# EAGLE schematic csa_bios_v3.0f (EAGLE 5.11)
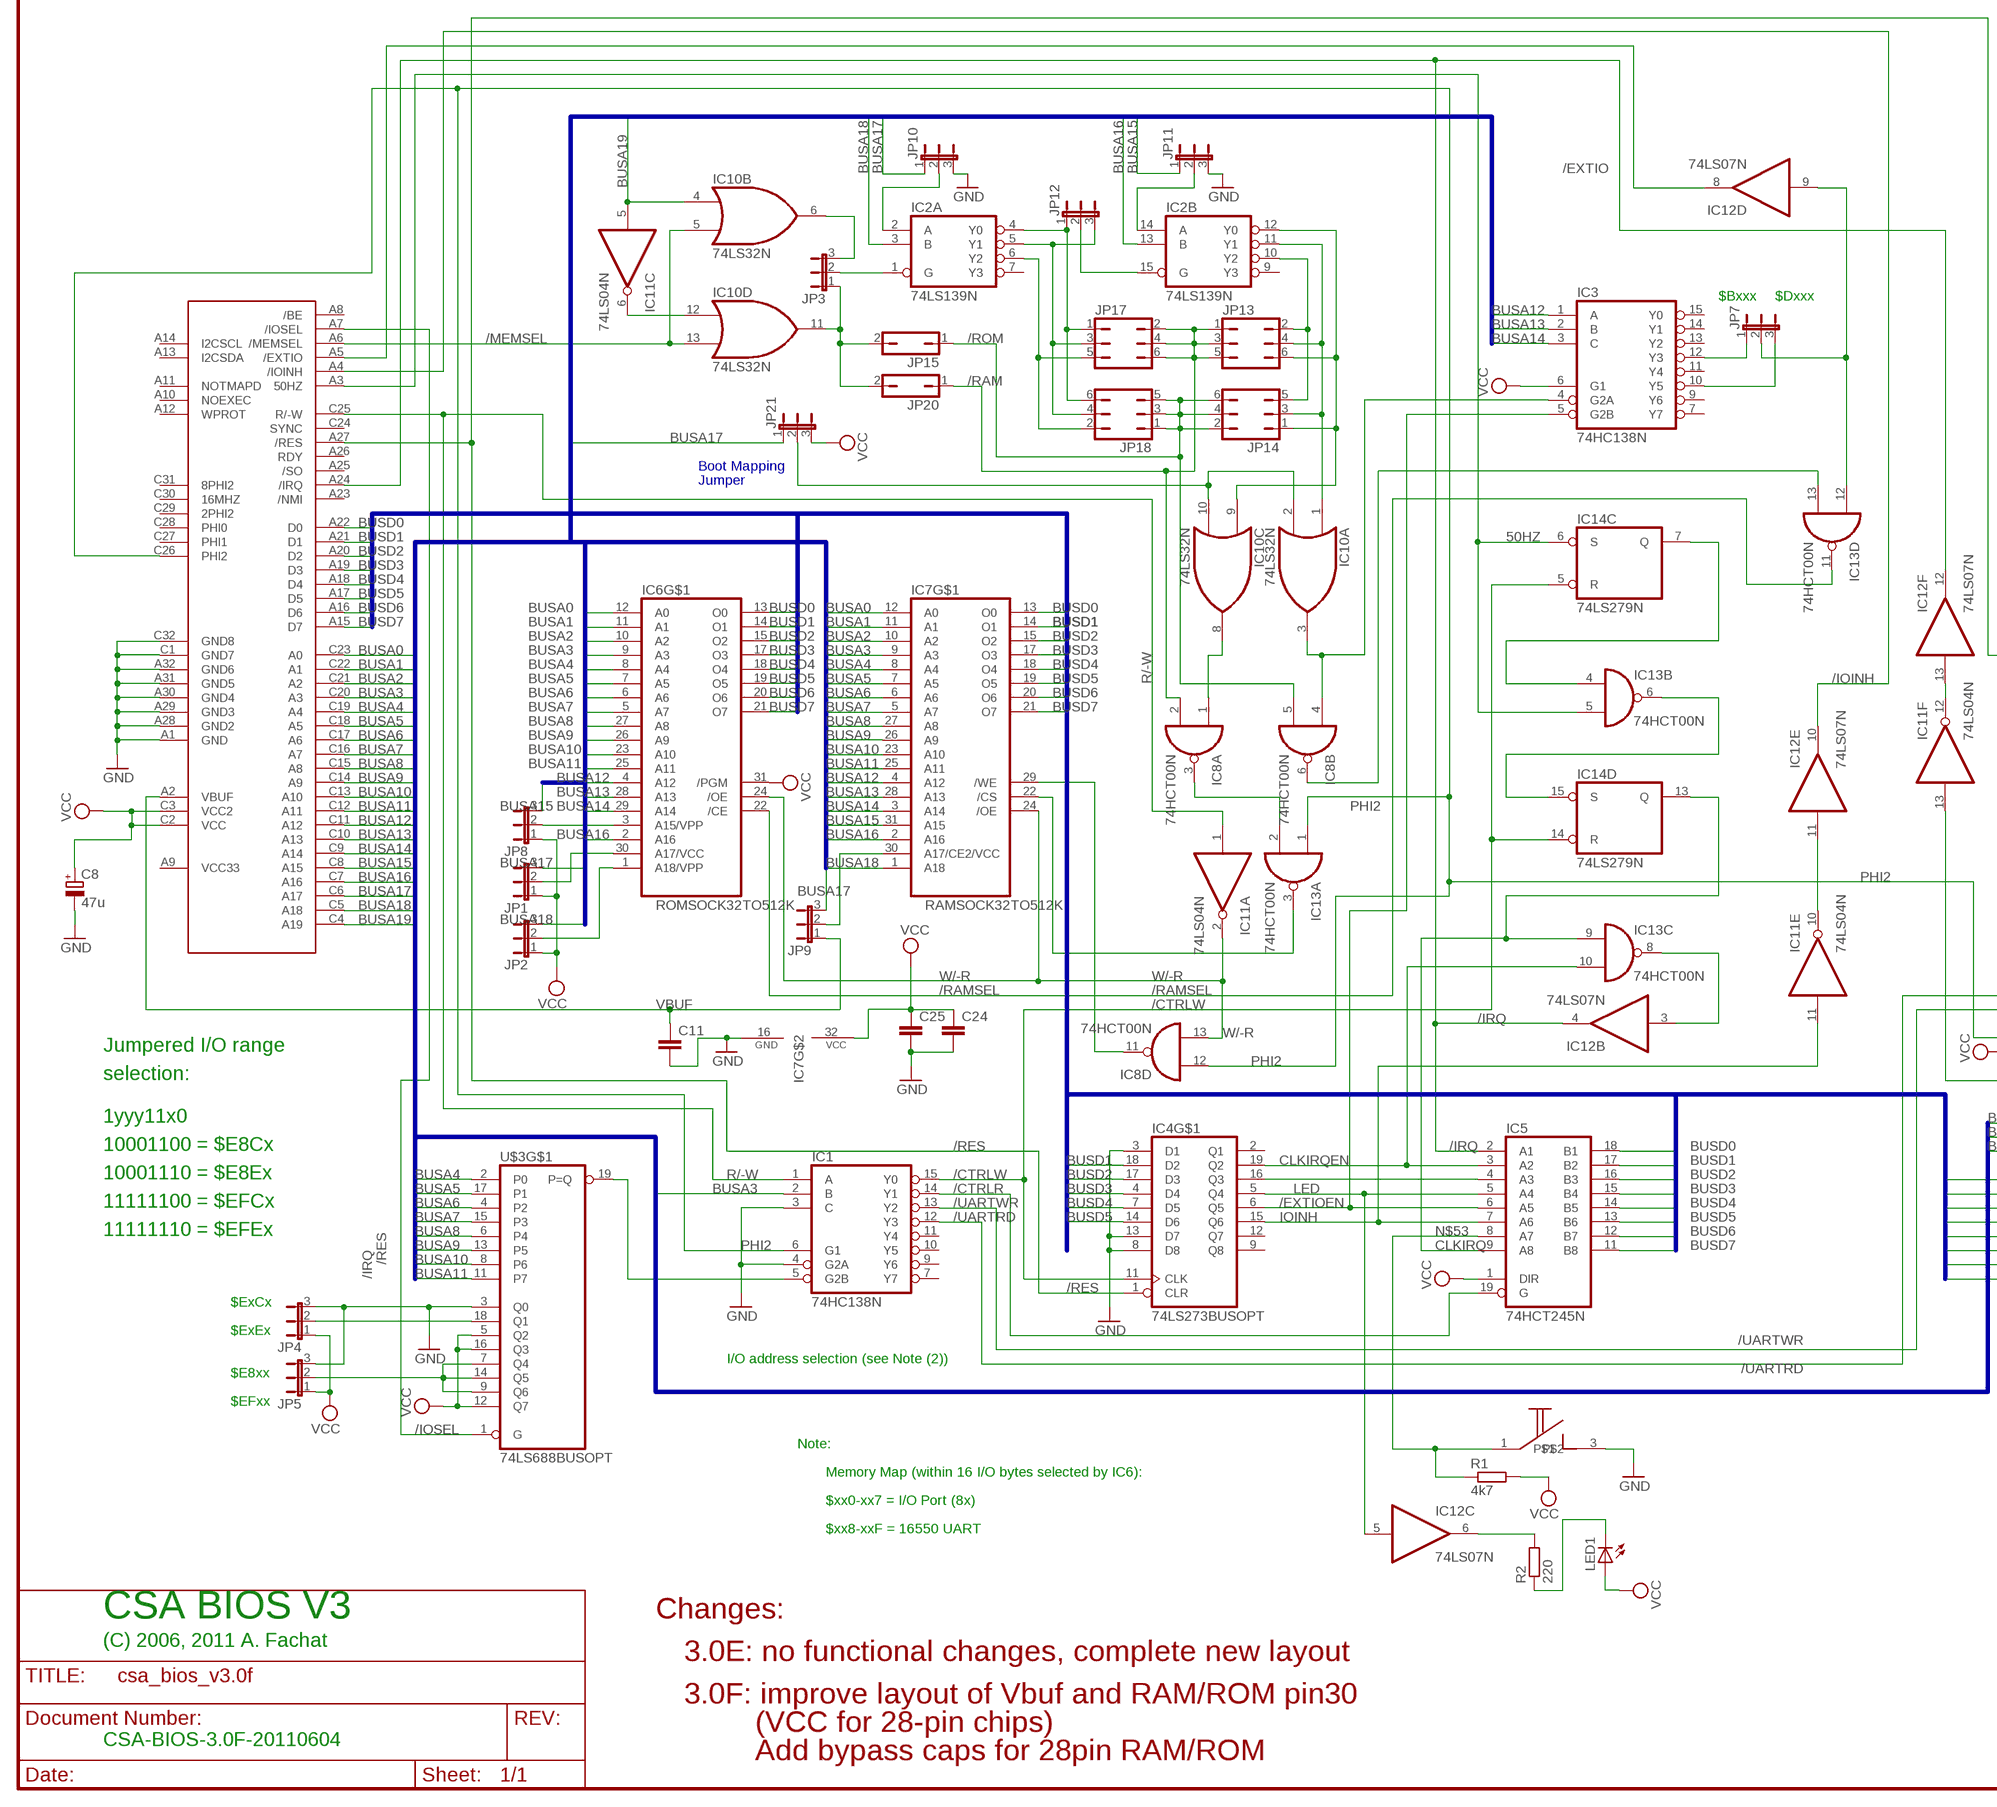
[diagram p0: schematic, sheet 1, part 1 of 2]
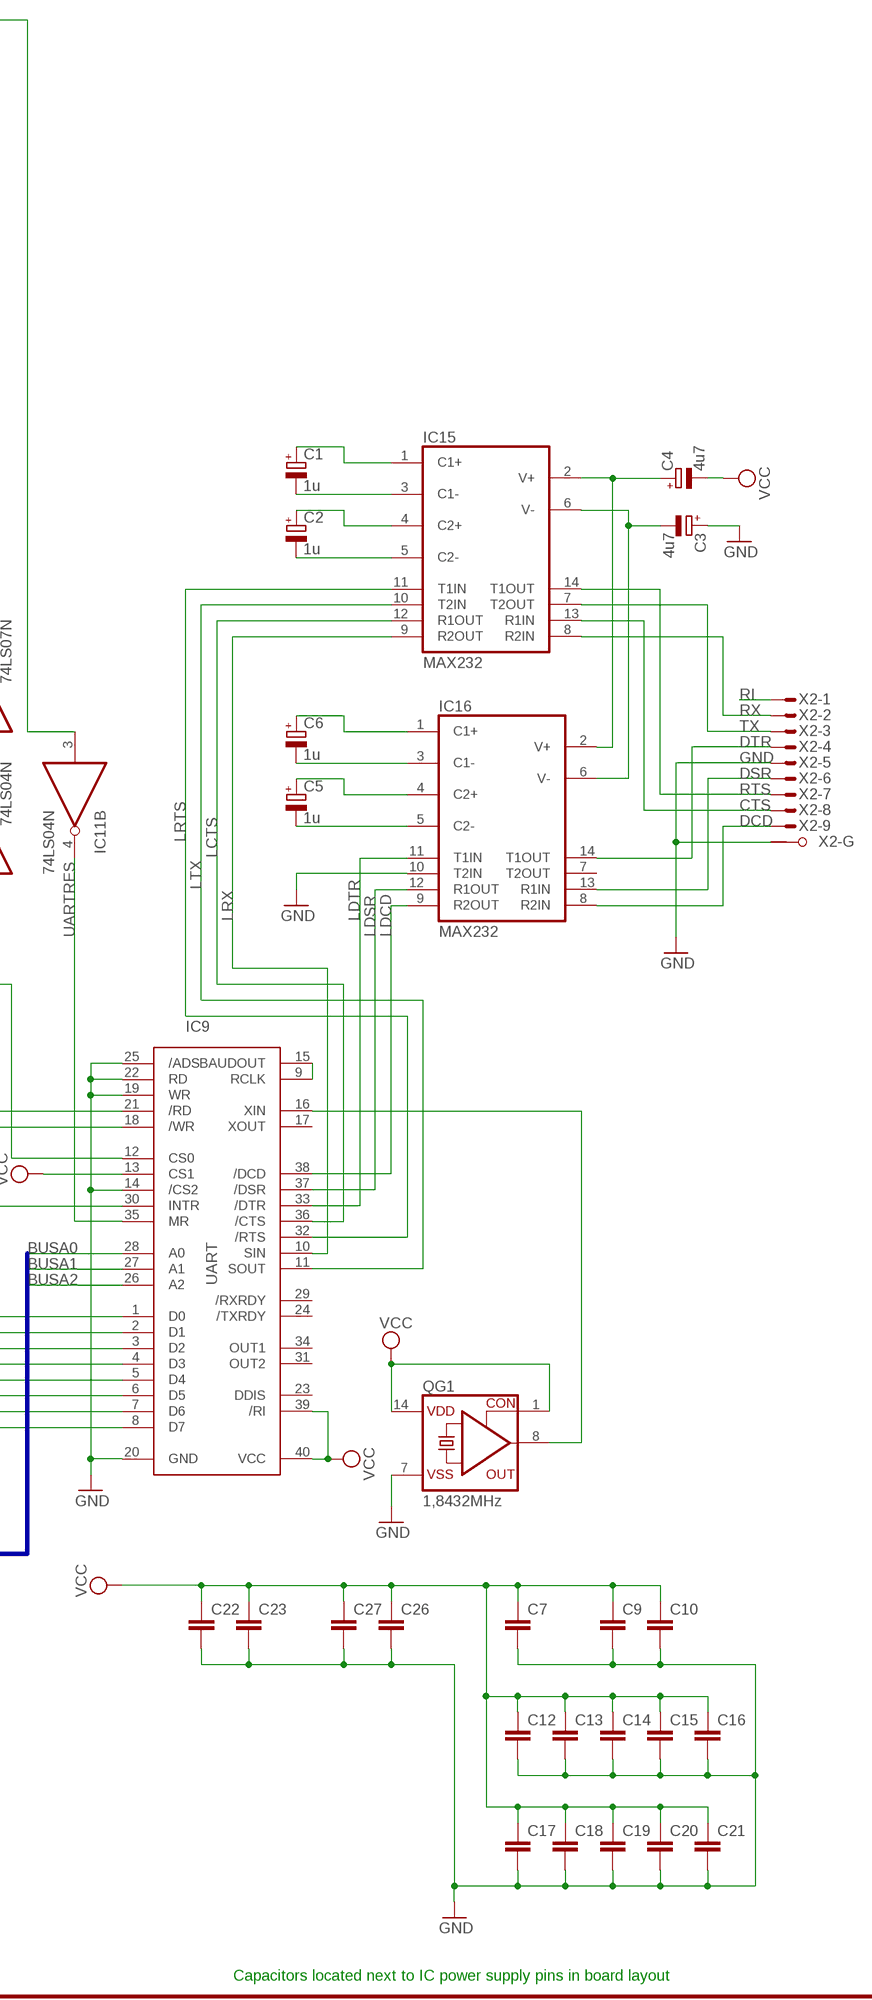
[diagram p1: schematic, sheet 1, part 2 of 2]

## Parts
C1  1u  CPOL-EUE2.5-6  [E2,5-6]
C2  1u  CPOL-EUE2.5-6  [E2,5-6]
C3  4u7  CPOL-EUE2.5-6  [E2,5-6]
C4  4u7  CPOL-EUE2.5-6  [E2,5-6]
C5  1u  CPOL-EUE2.5-6  [E2,5-6]
C6  1u  CPOL-EUE2.5-6  [E2,5-6]
C7  C-EU025-025X050  [C025-025X050]
C8  47u  CPOL-EUE2.5-7  [E2,5-7]
C9  C-EU025-025X050  [C025-025X050]
C10  C-EU025-025X050  [C025-025X050]
C11  C-EU025-025X050  [C025-025X050]
C12  C-EU025-025X050  [C025-025X050]
C13  C-EU025-025X050  [C025-025X050]
C14  C-EU025-025X050  [C025-025X050]
C15  C-EU025-025X050  [C025-025X050]
C16  C-EU025-025X050  [C025-025X050]
C17  C-EU025-025X050  [C025-025X050]
C18  C-EU025-025X050  [C025-025X050]
C19  C-EU025-025X050  [C025-025X050]
C20  C-EU025-025X050  [C025-025X050]
C21  C-EU025-025X050  [C025-025X050]
C22  C-EU025-025X050  [C025-025X050]
C23  C-EU025-025X050  [C025-025X050]
C24  C-EU025-025X050  [C025-025X050]
C25  C-EU025-025X050  [C025-025X050]
C26  C-EU025-025X050  [C025-025X050]
C27  C-EU025-025X050  [C025-025X050]
IC1  74HC138N  [DIL16]
IC2  74LS139N  [DIL16]
IC3  74HC138N  [DIL16]
IC4  74LS273BUSOPT  [DIL20]
IC5  74HCT245N  [DIL20]
IC6  ROMSOCK32TO512K  [DIL32OPT28]
IC7  RAMSOCK32TO512K  [DIL32OPT28]
IC8  74HCT00N  [DIL14]
IC9  UART  [DIL40]
IC10  74LS32N  [DIL14]
IC11  74LS04N  [DIL14]
IC12  74LS07N  [DIL14]
IC13  74HCT00N  [DIL14]
IC14  74LS279N  [DIL16]
IC15  MAX232  [DIL16]
IC16  MAX232  [DIL16]
JP1  JP2E  [JP2]
JP2  JP2E  [JP2]
JP3  JP2E  [JP2]
JP4  JP2E  [JP2]
JP5  JP2E  [JP2]
JP7  JP2E  [JP2]
JP8  JP2E  [JP2]
JP9  JP2E  [JP2]
JP10  JP2E  [JP2]
JP11  JP2E  [JP2]
JP12  JP2E  [JP2]
JP13  JP3Q  [JP3Q]
JP14  JP3Q  [JP3Q]
JP15  JP1Q  [JP1]
JP17  JP3Q  [JP3Q]
JP18  JP3Q  [JP3Q]
JP20  JP1Q  [JP1]
JP21  JP2E  [JP2]
LED1  LED5MM  [LED5MM]
QG1  1,8432MHz  CRYSTAL_RES-SG51  [SG51]
R1  4k7  R-EU_0204/7  [0204/7]
R2  220  R-EU_0207/10  [0207/10]
U$1  CSABUS  [CSABUS]
U$2  TASTER  [TASTER]
U$3  74LS688BUSOPT  [DIL20]
X2  M09HPS  [M09HP]

## Nets
50HZ: IC13.5(B:I1) IC14.6(C:S) U$1.A3(50HZ)
/CTRLR: IC1.14(Y1) IC5.19(G)
/CTRLW: IC1.15(Y0) IC4.11(CLK) IC14.5(C:R) IC14.14(D:R)
/EXTIO: IC12.8(D:O) U$1.A5(/EXTIO)
/EXTIOEN: IC3.5(G2B) IC4.6(Q5) IC5.6(A5)
/IOINH: IC12.10(E:O) U$1.A4(/IOINH)
/IOSEL: U$1.A7(/IOSEL) U$3.1(G)
/IRQ: IC5.2(A1) IC12.4(B:O) IC12.12(F:O) U$1.A24(/IRQ)
/MEMSEL: IC10.5(B:I1) IC10.13(D:I1) U$1.A6(/MEMSEL)
/RAM: IC8.2(A:I1) JP13.1 JP13.3 JP13.5 JP17.2 JP17.4 JP17.6 JP20.1
/RAMSEL: IC6.22(/CE) IC13.11(D:O)
/RES: IC4.1(CLR) IC11.3(B:I) U$1.A27(/RES)
/ROM: IC8.5(B:I1) JP14.2 JP14.4 JP14.6 JP15.1 JP18.1 JP18.3 JP18.5
/UARTRD: IC1.12(Y3) IC9.21(/RD)
/UARTWR: IC1.13(Y2) IC9.18(/WR)
BUSA0: IC6.12(A0) IC7.12(A0) IC9.28(A0) U$1.C23(A0)
BUSA1: IC6.11(A1) IC7.11(A1) IC9.27(A1) U$1.C22(A1)
BUSA2: IC6.10(A2) IC7.10(A2) IC9.26(A2) U$1.C21(A2)
BUSA3: IC1.2(B) IC6.9(A3) IC7.9(A3) U$1.C20(A3)
BUSA4: IC6.8(A4) IC7.8(A4) U$1.C19(A4) U$3.2(P0)
BUSA5: IC6.7(A5) IC7.7(A5) U$1.C18(A5) U$3.17(P1)
BUSA6: IC6.6(A6) IC7.6(A6) U$1.C17(A6) U$3.4(P2)
BUSA7: IC6.5(A7) IC7.5(A7) U$1.C16(A7) U$3.15(P3)
BUSA8: IC6.27(A8) IC7.27(A8) U$1.C15(A8) U$3.6(P4)
BUSA9: IC6.26(A9) IC7.26(A9) U$1.C14(A9) U$3.13(P5)
BUSA10: IC6.23(A10) IC7.23(A10) U$1.C13(A10) U$3.8(P6)
BUSA11: IC6.25(A11) IC7.25(A11) U$1.C12(A11) U$3.11(P7)
BUSA12: IC3.1(A) IC6.4(A12) IC7.4(A12) U$1.C11(A12)
BUSA13: IC3.2(B) IC6.28(A13) IC7.28(A13) U$1.C10(A13)
BUSA14: IC3.3(C) IC6.29(A14) IC7.3(A14) U$1.C9(A14)
BUSA15: IC7.31(A15) JP8.3 JP11.1 U$1.C8(A15)
BUSA16: IC2.13(B:B) IC6.2(A16) IC7.2(A16) U$1.C7(A16)
BUSA17: JP1.3 JP9.3 JP10.1 JP21.1 U$1.C6(A17)
BUSA17X: IC10.2(A:I1) IC10.10(C:I1) JP21.2
BUSA18: IC2.3(A:B) IC7.1(A18) JP2.3 U$1.C5(A18)
BUSA19: IC10.4(B:I0) IC11.5(C:I) U$1.C4(A19)
BUSD0: IC5.18(B1) IC6.13(O0) IC7.13(O0) IC9.1(D0) U$1.A22(D0)
BUSD1: IC4.18(D2) IC5.17(B2) IC6.14(O1) IC7.14(O1) IC9.2(D1) U$1.A21(D1)
BUSD2: IC4.17(D3) IC5.16(B3) IC6.15(O2) IC7.15(O2) IC9.3(D2) U$1.A20(D2)
BUSD3: IC4.4(D4) IC5.15(B4) IC6.17(O3) IC7.17(O3) IC9.4(D3) U$1.A19(D3)
BUSD4: IC4.7(D5) IC5.14(B5) IC6.18(O4) IC7.18(O4) IC9.5(D4) U$1.A18(D4)
BUSD5: IC4.14(D6) IC5.13(B6) IC6.19(O5) IC7.19(O5) IC9.6(D5) U$1.A17(D5)
BUSD6: IC5.12(B7) IC6.20(O6) IC7.20(O6) IC9.7(D6) U$1.A16(D6)
BUSD7: IC5.11(B8) IC6.21(O7) IC7.21(O7) IC9.8(D7) U$1.A15(D7)
CLKIRQ: IC5.9(A8) IC13.9(C:I0) IC14.13(D:Q)
CLKIRQEN: IC4.19(Q2) IC5.3(A2) IC13.10(C:I1)
CTS: IC15.13(R1IN) X2.8(-8:M)
DCD: IC16.8(R2IN) X2.9(-9:M)
DSR: IC16.13(R1IN) X2.6(-6:M)
DTR: IC16.14(T1OUT) X2.4(-4:M)
GND: C3.+ C7.2 C8.- C9.2 C10.2 C11.2 C12.2 C13.2 C14.2 C15.2 C16.2 C17.2 C18.2 C19.2 C20.2 C21.2 C22.2 C23.2 C24.2 C25.2 C26.2 C27.2 IC1.3(C) IC1.4(G2A) IC4.3(D1) IC4.8(D8) IC4.13(D7) IC7.16(GND) IC9.14(/CS2) IC9.19(WR) IC9.20(GND) IC9.22(RD) IC9.25(/ADS) IC16.10(T2IN) JP4.3 JP5.3 JP10.3 JP11.3 QG1.7(VSS) U$1.A1(GND) U$1.A28(GND2) U$1.A29(GND3) U$1.A30(GND4) U$1.A31(GND5) U$1.A32(GND6) U$1.C1(GND7) U$1.C32(GND8) U$2.3 U$3.3(Q0) X2.5(-5:M) X2.G1(-G:G1)
IOINH: IC4.15(Q6) IC5.7(A6) IC11.11(E:I)
LCTS: IC9.36(/CTS) IC15.12(R1OUT)
LDCD: IC9.38(/DCD) IC16.9(R2OUT)
LDSR: IC9.37(/DSR) IC16.12(R1OUT)
LDTR: IC9.33(/DTR) IC16.11(T1IN)
LED: IC4.5(Q4) IC5.5(A4) IC12.5(C:I)
LRTS: IC9.32(/RTS) IC15.11(T1IN)
LRX: IC9.10(SIN) IC15.9(R2OUT)
LTX: IC9.11(SOUT) IC15.10(T2IN)
N$2: IC6.3(A15/VPP) JP8.2
N$3: IC9.9(RCLK) IC9.15(BAUDOUT)
N$4: IC6.30(A17/VCC) JP1.2
N$5: IC6.1(A18/VPP) JP2.2
N$6: IC1.5(G2B) U$3.19(P=Q)
N$7: IC7.22(/CS) IC13.3(A:O)
N$9: IC7.30(A17/CE2/VCC) JP9.2
N$10: IC2.6(A:Y2) JP17.5 JP18.2
N$11: IC13.4(B:I0) IC14.7(C:Q)
N$12: IC2.10(B:Y2) JP13.2 JP14.5
N$13: IC10.12(D:I0) IC11.6(C:O)
N$14: IC10.6(B:O) JP3.3
N$15: IC10.11(D:O) JP3.1 JP15.2 JP20.2
N$16: IC2.1(A:G) JP3.2
N$19: IC4.16(Q3) IC5.4(A3)
N$20: IC2.2(A:A) JP10.2
N$21: IC2.14(B:A) JP11.2
N$22: IC2.4(A:Y0) JP12.1 JP17.1 JP18.6
N$23: IC8.1(A:I0) IC10.8(C:O)
N$24: JP4.2 U$3.18(Q1)
N$26: IC13.6(B:O) IC14.15(D:S)
N$27: IC2.5(A:Y1) JP12.3 JP17.3 JP18.4
N$28: IC2.15(B:G) JP12.2
N$29: IC12.3(B:I) IC13.8(C:O)
N$30: IC2.11(B:Y1) IC10.1(A:I0) JP13.4 JP14.3
N$31: IC12.6(C:O) R2.2
N$32: LED1.K(C) R2.1
N$33: IC12.9(D:I) IC13.12(D:I0) JP7.2
N$34: IC7.29(/WE) IC8.11(D:O)
N$35: IC11.10(E:O) IC12.11(E:I)
N$36: IC2.12(B:Y0) IC10.9(C:I0) JP13.6 JP14.1
N$37: IC8.6(B:O) IC13.13(D:I1)
N$38: IC8.3(A:O) IC13.2(A:I1)
N$39: IC9.16(XIN) QG1.8(OUT)
N$40: IC11.12(F:O) IC12.13(F:I)
N$41: C1.- IC15.3(C1-)
N$42: C1.+ IC15.1(C1+)
N$43: C6.- IC16.3(C1-)
N$44: C6.+ IC16.1(C1+)
N$45: C2.- IC15.5(C2-)
N$46: C2.+ IC15.4(C2+)
N$47: C5.- IC16.5(C2-)
N$48: C5.+ IC16.4(C2+)
N$49: C3.- IC15.6(V-) IC16.6(V-)
N$50: C4.+ IC15.2(V+) IC16.2(V+)
N$53: IC5.8(A7) R1.1 U$2.1
N$54: IC3.4(G2A) IC8.4(B:I0) IC10.3(A:O)
N$71: JP5.2 U$3.7(Q4) U$3.9(Q6) U$3.14(Q5)
N$74: IC3.12(Y3) JP7.1
N$75: IC3.10(Y5) JP7.3
PHI2: IC1.6(G1) IC8.12(D:I0) IC9.12(CS0) IC13.1(A:I0) U$1.C26(PHI2)
R/-W: IC1.1(A) IC11.1(A:I) U$1.C25(R/-W)
RI: X2.1(-1:M)
RTS: IC15.14(T1OUT) X2.7(-7:M)
RX: IC15.8(R2IN) X2.2(-2:M)
TX: IC15.7(T2OUT) X2.3(-3:M)
UARTINT: IC9.30(INTR) IC11.13(F:I)
UARTRES: IC9.35(MR) IC11.4(B:O)
VBUF: C11.1 JP9.1 U$1.A2(VBUF)
VCC: C4.- C7.1 C8.+ C9.1 C10.1 C12.1 C13.1 C14.1 C15.1 C16.1 C17.1 C18.1 C19.1 C20.1 C21.1 C22.1 C23.1 C24.1 C25.1 C26.1 C27.1 IC3.6(G1) IC5.1(DIR) IC6.31(/PGM) IC7.32(VCC) IC9.13(CS1) IC9.39(/RI) IC9.40(VCC) JP1.1 JP2.1 JP4.1 JP5.1 JP8.1 JP21.3 LED1.A QG1.1(CON) QG1.14(VDD) R1.2 U$1.C2(VCC) U$1.C3(VCC2) U$3.5(Q2) U$3.12(Q7) U$3.16(Q3)
W/-R: IC6.24(/OE) IC7.24(/OE) IC8.13(D:I1) IC11.2(A:O)
Unconnected: IC1.7(Y7) IC1.9(Y6) IC1.10(Y5) IC1.11(Y4) IC2.7(A:Y3) IC2.9(B:Y3) IC3.7(Y7) IC3.9(Y6) IC3.11(Y4) IC3.13(Y2) IC3.14(Y1) IC3.15(Y0) IC4.2(Q1) IC4.9(Q8) IC4.12(Q7) IC8.8(C:O) IC8.9(C:I0) IC8.10(C:I1) IC9.17(XOUT) IC9.23(DDIS) IC9.24(/TXRDY) IC9.29(/RXRDY) IC9.31(OUT2) IC9.34(OUT1) IC11.8(D:O) IC11.9(D:I) IC12.1(A:I) IC12.2(A:O) IC14.1(A:R) IC14.2(A:S1) IC14.3(A:S2) IC14.4(A:Q) IC14.9(B:Q) IC14.10(B:R) IC14.11(B:S1) IC14.12(B:S2) IC16.7(T2OUT) U$1.A8(/BE) U$1.A9(VCC33) U$1.A10(NOEXEC) U$1.A11(NOTMAPD) U$1.A12(WPROT) U$1.A13(I2CSDA) U$1.A14(I2CSCL) U$1.A23(/NMI) U$1.A25(/SO) U$1.A26(RDY) U$1.C24(SYNC) U$1.C27(PHI1) U$1.C28(PHI0) U$1.C29(2PHI2) U$1.C30(16MHZ) U$1.C31(8PHI2) X2.G2(-G:G2)

## Buses
BUSD[0..7]
BUSA[0..19]

## Notes on the sheet
- $Bxxx | $Dxxx
- Boot Mapping
- Jumper
- Jumpered I/O range
- selection:
- 1yyy11x0
- 10001100 = $E8Cx
- 10001110 = $E8Ex
- 11111100 = $EFCx
- 11111110 = $EFEx
- $ExCx
- $ExEx
- I/O address selection (see Note (2))
- $E8xx
- $EFxx
- Note:
- Memory Map (within 16 I/O bytes selected by IC6):
- $xx0-xx7 = I/O Port (8x)
- $xx8-xxF = 16550 UART
- CSA BIOS V3 | Changes:
- (C) 2006, 2011 A. Fachat
- 3.0E: no functional changes, complete new layout
- 3.0F: improve layout of Vbuf and RAM/ROM pin30
- (VCC for 28-pin chips)
- CSA-BIOS-3.0F-20110604
- Add bypass caps for 28pin RAM/ROM
- Capacitors located next to IC power supply pins in board layout

## Power pins joined to a net without a drawn wire
GND: IC1.8(GND) IC2.8(P:GND) IC3.8(GND) IC4.10(GND) IC5.10(GND) IC6.16(GND) IC8.7(P:GND) IC10.7(P:GND) IC11.7(P:GND) IC12.7(P:GND) IC13.7(P:GND) IC14.8(P:GND) IC15.15(GND) IC16.15(GND) U$3.10(GND)
VCC: IC1.16(VCC) IC2.16(P:VCC) IC3.16(VCC) IC4.20(VCC) IC5.20(VCC) IC6.32(VCC) IC8.14(P:VCC) IC10.14(P:VCC) IC11.14(P:VCC) IC12.14(P:VCC) IC13.14(P:VCC) IC14.16(P:VCC) IC15.16(VCC) IC16.16(VCC) U$3.20(VCC)

## Library data of the parts
C1-C6 C8 = rcl:CPOL-EU: POLARIZED CAPACITOR, European symbol
C7 C9-C27 = rcl:C-EU: CAPACITOR, European symbol
IC1 IC3 = 74xx-eu:74*138: 3-line to 8-line DECODER/DEMULTIPLEXER
IC2 = 74xx-eu:74*139: Dual 2-line to 4-line DECODER/DEMULTIPLEXER
IC4 = csa:74LS273BUSOPT
IC5 = 74xx-eu:74*245: Octal BUS TRANSCEIVER, 3-state
IC6 = csa:ROMSOCK32TO512K
IC7 = csa:RAMSOCK32TO512K
IC8 IC13 = 74xx-eu:74*00: Quad 2-input NAND gate
IC9 = csa:UART
IC10 = 74xx-us:74*32: Quad 2-input OR gate
IC11 = 74xx-us:74*04: Hex INVERTER
IC12 = 74xx-us:74*07: Hex BUFFER, open collector high-voltage output
IC14 = 74xx-us:74*279: Quadruple S-R LATCH
IC15 IC16 = maxim:MAX232: RS232 TRANSEIVER
JP1-JP5 JP7-JP12 JP21 = jumper:JP2E: JUMPER
JP13 JP14 JP17 JP18 = jumper:JP3Q: JUMPER
JP15 JP20 = jumper:JP1Q: JUMPER
LED1 = led:LED: LED OSRAM: - CHIPLED LG R971, LG N971, LY N971, LG Q971, LY Q971, LO R971, LY R971 LH N974, LH R974 LS Q976, LO Q976, LY Q976 LO Q996 - Hyper CHIPLED LW Q18S LB Q993, LB Q99A, LB R99A - SideLED LS A670, LO A670, LY A670, LG A670, LP A670 LB A673, LV A673, LT A673, LW A673 LH A674 LY A675 LS A676, LA A676, LO A676, LY A676, LW A676 LS A679, LY A679, LG A679 - Hyper Micro SIDELED® LS Y876, LA Y876, LO Y876, LY Y876 LT Y87S - SmartLED LW L88C, LW L88S LB L89C, LB L89S, LG L890 LS L89K, LO L89K, LY L89K LS L896, LA L896, LO L896, LY L896 - TOPLED LS T670, LO T670, LY T670, LG T670, LP T670 LSG T670, LSP T670, LSY T670, LOP T670, LYG T670 LG T671, LOG T671, LSG T671 LB T673, LV T673, LT T673, LW T673 LH T674 LS T676, LA T676, LO T676, LY T676, LB T676, LH T676, LSB T676, LW T676 LB T67C, LV T67C, LT T67C, LS T67K, LO T67K, LY T67K, LW E67C LS E67B, LA E67B, LO E67B, LY E67B, LB E67C, LV E67C, LT E67C LW T67C LS T679, LY T679, LG T679 LS T770, LO T770, LY T770, LG T770, LP T770 LB T773, LV T773, LT T773, LW T773 LH T774 LS E675, LA E675, LY E675, LS T675 LS T776, LA T776, LO T776, LY T776, LB T776 LHGB T686 LT T68C, LB T68C - Hyper Mini TOPLED® LB M676 - Mini TOPLED Santana® LG M470 LS M47K, LO M47K, LY M47K Source: http://www.osram.convergy.de/
QG1 = crystal:CRYSTAL_RES-: CRYSTAL RESONATOR
R1 R2 = rcl:R-EU_: RESISTOR, European symbol
U$1 = csa:CSABUS
U$2 = csa:TASTER
U$3 = csa:74LS688BUSOPT
X2 = con-subd:M09HPS: SUB-D